# Altium schematic sheet FPGA_FPGA.SchDoc
size A2
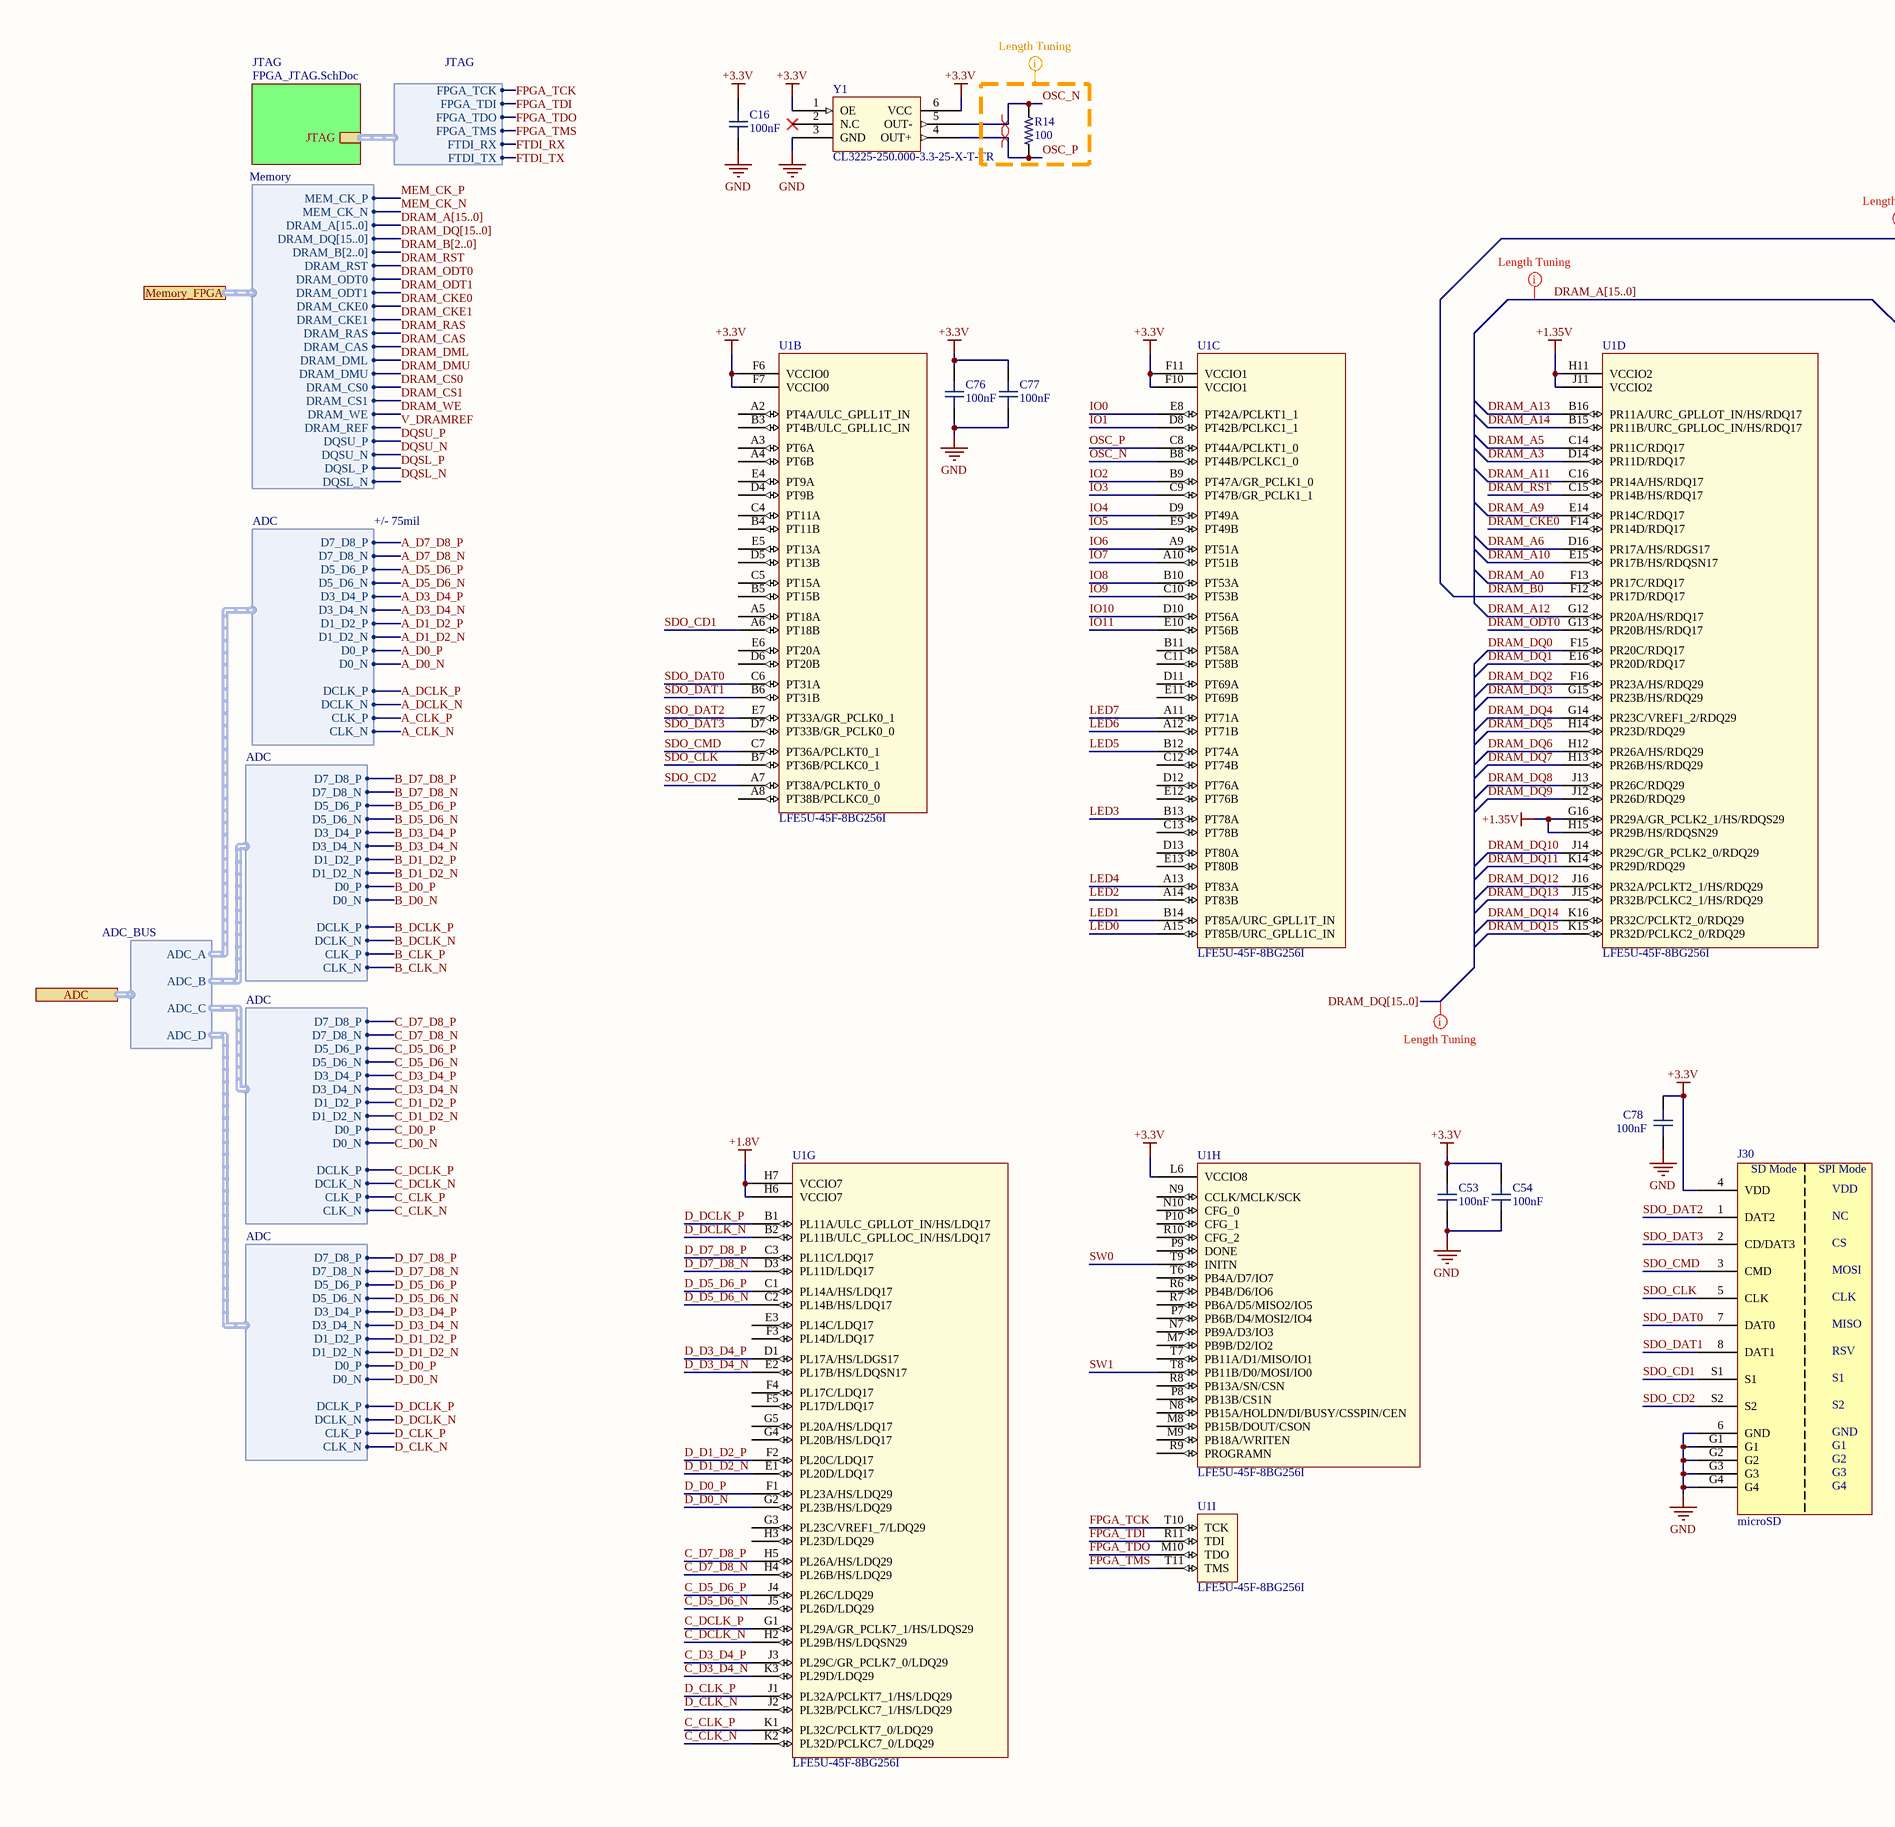
[diagram p0: FPGA_FPGA.SchDoc, left]
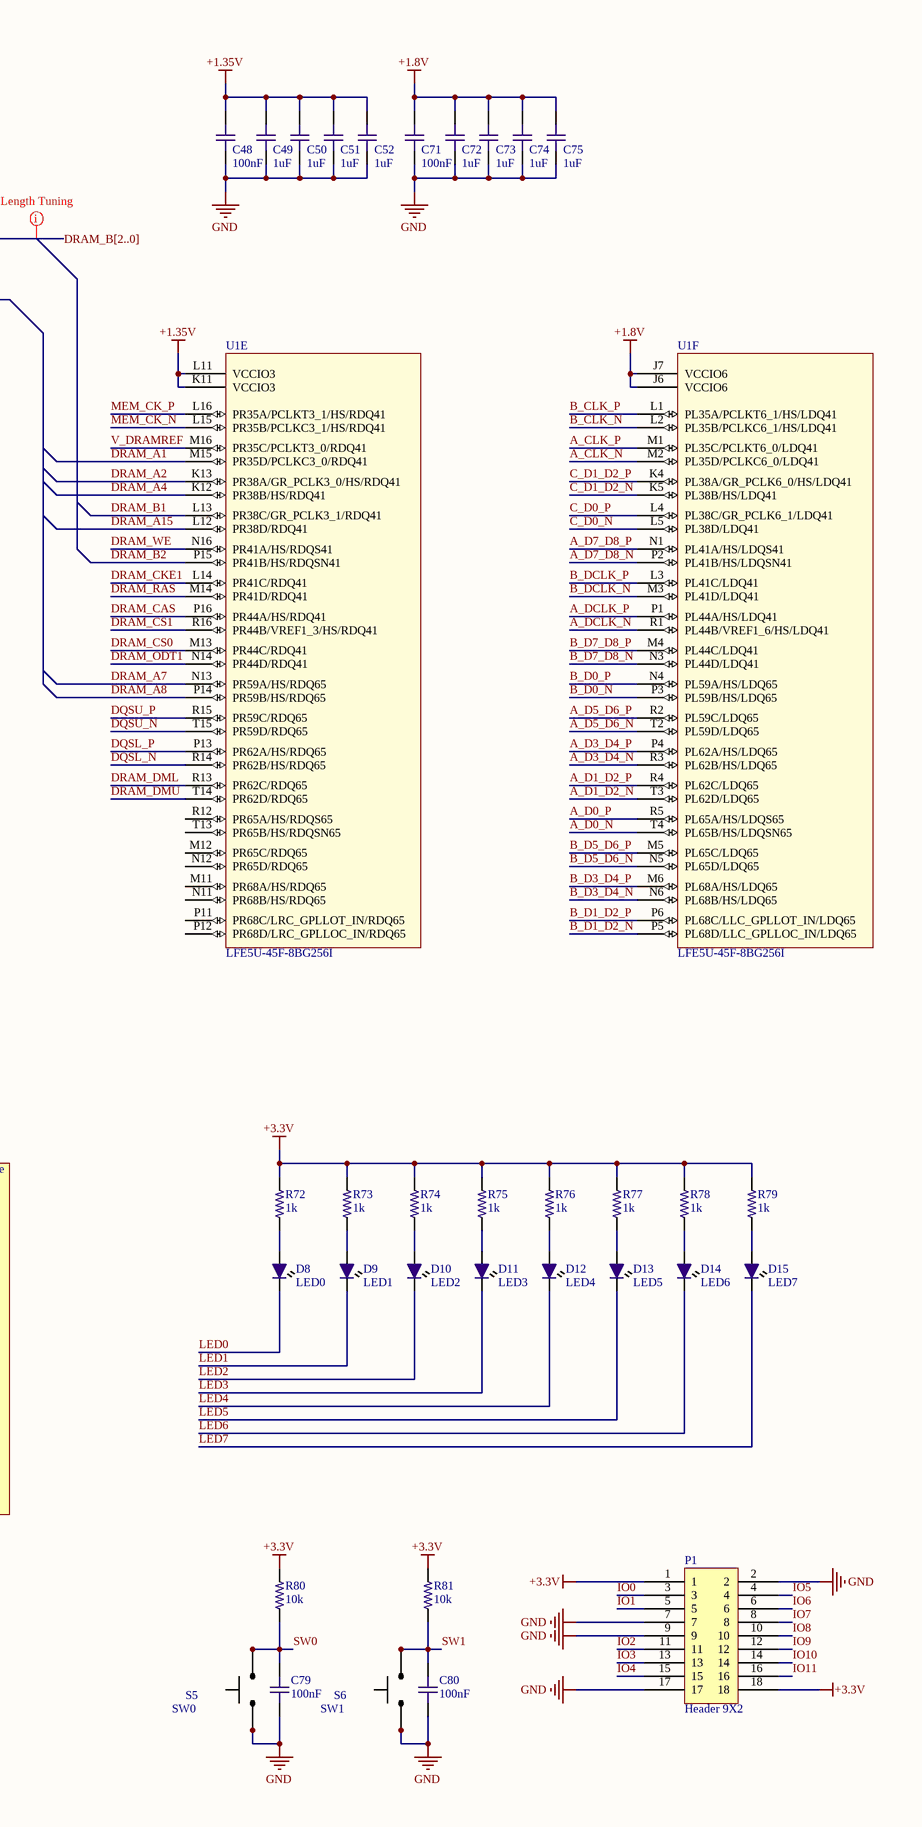
[diagram p1: FPGA_FPGA.SchDoc, right]

## Parts
C16  value 100nF  [C0603-HIGH-DENSITY]  (hidden comment: C0603 100nF 25V X7R)
C48  value 100nF  [C0603-HIGH-DENSITY]  (hidden comment: C0603 100nF 25V X7R)
C49  value 1uF  [C0603-HIGH-DENSITY]  (hidden comment: C0603 1uF 25V X7R)
C50  value 1uF  [C0603-HIGH-DENSITY]  (hidden comment: C0603 1uF 25V X7R)
C51  value 1uF  [C0603-HIGH-DENSITY]  (hidden comment: C0603 1uF 25V X7R)
C52  value 1uF  [C0603-HIGH-DENSITY]  (hidden comment: C0603 1uF 25V X7R)
C53  value 100nF  [C0603-HIGH-DENSITY]  (hidden comment: C0603 100nF 25V X7R)
C54  value 100nF  [C0603-HIGH-DENSITY]  (hidden comment: C0603 100nF 25V X7R)
C71  value 100nF  [C0603-HIGH-DENSITY]  (hidden comment: C0603 100nF 25V X7R)
C72  value 1uF  [C0603-HIGH-DENSITY]  (hidden comment: C0603 1uF 25V X7R)
C73  value 1uF  [C0603-HIGH-DENSITY]  (hidden comment: C0603 1uF 25V X7R)
C74  value 1uF  [C0603-HIGH-DENSITY]  (hidden comment: C0603 1uF 25V X7R)
C75  value 1uF  [C0603-HIGH-DENSITY]  (hidden comment: C0603 1uF 25V X7R)
C76  value 100nF  [C0603-HIGH-DENSITY]  (hidden comment: C0603 100nF 25V X7R)
C77  value 100nF  [C0603-HIGH-DENSITY]  (hidden comment: C0603 100nF 25V X7R)
C78  value 100nF  [C0603-HIGH-DENSITY]  (hidden comment: C0603 100nF 25V X7R)
C79  value 100nF  [C0603-HIGH-DENSITY]  (hidden comment: C0603 100nF 25V X7R)
C80  value 100nF  [C0603-HIGH-DENSITY]  (hidden comment: C0603 100nF 25V X7R)
D8  LED0  [LED0603-IPC]
D9  LED1  [LED0603-IPC]
D10  LED2  [LED0603-IPC]
D11  LED3  [LED0603-IPC]
D12  LED4  [LED0603-IPC]
D13  LED5  [LED0603-IPC]
D14  LED6  [LED0603-IPC]
D15  LED7  [LED0603-IPC]
J30  microSD  [1040310811]
P1  Header 9X2  [Header 9X2]
R14  value 100  [R0402-HIGH-DENSITY]  (hidden comment: R0402 100R 1%)
R72  value 1k  [R0603-IPC]  (hidden comment: R0603 1K 1%)
R73  value 1k  [R0603-IPC]  (hidden comment: R0603 1K 1%)
R74  value 1k  [R0603-IPC]  (hidden comment: R0603 1K 1%)
R75  value 1k  [R0603-IPC]  (hidden comment: R0603 1K 1%)
R76  value 1k  [R0603-IPC]  (hidden comment: R0603 1K 1%)
R77  value 1k  [R0603-IPC]  (hidden comment: R0603 1K 1%)
R78  value 1k  [R0603-IPC]  (hidden comment: R0603 1K 1%)
R79  value 1k  [R0603-IPC]  (hidden comment: R0603 1K 1%)
R80  value 10k  [R0603-IPC]  (hidden comment: R0603 10K 1%)
R81  value 10k  [R0603-IPC]  (hidden comment: R0603 10K 1%)
S5  SW0  [TL3342F260QG]
S6  SW1  [TL3342F260QG]
U1  LFE5U-45F-8BG256I  [caBGA256]  (parts B,C,D,E,F,G,H,I of 9)
Y1  CL3225-250.000-3.3-25-X-T-TR  [Raltron CL3225]

## Sub-sheets
JTAG = FPGA_JTAG.SchDoc: JTAG (harness JTAG)

## Ports
ADC (harness ADC_BUS), Memory_FPGA (harness Memory)

## Harnesses
JTAG: FPGA_TCK, FPGA_TDI, FPGA_TDO, FPGA_TMS, FTDI_RX, FTDI_TX
ADC_BUS: ADC_A, ADC_B, ADC_C, ADC_D
ADC: D7_D8_P, D7_D8_N, D5_D6_P, D5_D6_N, D3_D4_P, D3_D4_N, D1_D2_P, D1_D2_N, D0_P, D0_N, CLK_P, CLK_N, DCLK_P, DCLK_N
Memory: MEM_CK_P, MEM_CK_N, DRAM_A[15..0], DRAM_DQ[15..0], DRAM_B[2..0], DRAM_RST, DRAM_ODT0, DRAM_ODT1, DRAM_CKE0, DRAM_CKE1, DRAM_RAS, DRAM_CAS, DRAM_DML, DRAM_DMU, DRAM_CS0, DRAM_CS1, DRAM_WE, DRAM_REF, DQSU_P, DQSU_N, DQSL_P, DQSL_N

## Nets
+1.8V: C71.2 C72.2 C73.2 C74.2 C75.2 U1.H6(VCCIO7) U1.H7(VCCIO7) U1.J6(VCCIO6) U1.J7(VCCIO6)
+1.35V: C48.2 C49.2 C50.2 C51.2 C52.2 U1.G16(PR29A/GR_PCLK2_1/HS/RDQS29) U1.H11(VCCIO2) U1.H15(PR29B/HS/RDQSN29) U1.J11(VCCIO2) U1.K11(VCCIO3) U1.L11(VCCIO3)
+3.3V: C16.2 C53.2 C54.2 C76.2 C77.2 C78.1 J30.4(VDD) P1.1 P1.18 R72.2 R73.2 R74.2 R75.2 R76.2 R77.2 R78.2 R79.2 R80.2 R81.2 U1.F6(VCCIO0) U1.F7(VCCIO0) U1.F10(VCCIO1) U1.F11(VCCIO1) U1.L6(VCCIO8) Y1.1(OE) Y1.6(VCC)
GND: C16.1 C48.1 C49.1 C50.1 C51.1 C52.1 C53.1 C54.1 C71.1 C72.1 C73.1 C74.1 C75.1 C76.1 C77.1 C78.2 C79.1 C80.1 J30.6(GND) J30.G1 J30.G2 J30.G3 J30.G4 P1.2 P1.7 P1.9 P1.17 S5.3 S5.4 S6.3 S6.4 Y1.3(GND)
A_CLK_N: U1.M2(PL35D/PCLKC6_0/LDQ41) ; harness ADC.CLK_N
A_CLK_P: U1.M1(PL35C/PCLKT6_0/LDQ41) ; harness ADC.CLK_P
A_D0_N: U1.T4(PL65B/HS/LDQSN65) ; harness ADC.D0_N
A_D0_P: U1.R5(PL65A/HS/LDQS65) ; harness ADC.D0_P
A_D1_D2_N: U1.T3(PL62D/LDQ65) ; harness ADC.D1_D2_N
A_D1_D2_P: U1.R4(PL62C/LDQ65) ; harness ADC.D1_D2_P
A_D3_D4_N: U1.R3(PL62B/HS/LDQ65) ; harness ADC.D3_D4_N
A_D3_D4_P: U1.P4(PL62A/HS/LDQ65) ; harness ADC.D3_D4_P
A_D5_D6_N: U1.T2(PL59D/LDQ65) ; harness ADC.D5_D6_N
A_D5_D6_P: U1.R2(PL59C/LDQ65) ; harness ADC.D5_D6_P
A_D7_D8_N: U1.P2(PL41B/HS/LDQSN41) ; harness ADC.D7_D8_N
A_D7_D8_P: U1.N1(PL41A/HS/LDQS41) ; harness ADC.D7_D8_P
A_DCLK_N: U1.R1(PL44B/VREF1_6/HS/LDQ41) ; harness ADC.DCLK_N
A_DCLK_P: U1.P1(PL44A/HS/LDQ41) ; harness ADC.DCLK_P
B_CLK_N: U1.L2(PL35B/PCLKC6_1/HS/LDQ41) ; harness ADC.CLK_N
B_CLK_P: U1.L1(PL35A/PCLKT6_1/HS/LDQ41) ; harness ADC.CLK_P
B_D0_N: U1.P3(PL59B/HS/LDQ65) ; harness ADC.D0_N
B_D0_P: U1.N4(PL59A/HS/LDQ65) ; harness ADC.D0_P
B_D1_D2_N: U1.P5(PL68D/LLC_GPLLOC_IN/LDQ65) ; harness ADC.D1_D2_N
B_D1_D2_P: U1.P6(PL68C/LLC_GPLLOT_IN/LDQ65) ; harness ADC.D1_D2_P
B_D3_D4_N: U1.N6(PL68B/HS/LDQ65) ; harness ADC.D3_D4_N
B_D3_D4_P: U1.M6(PL68A/HS/LDQ65) ; harness ADC.D3_D4_P
B_D5_D6_N: U1.N5(PL65D/LDQ65) ; harness ADC.D5_D6_N
B_D5_D6_P: U1.M5(PL65C/LDQ65) ; harness ADC.D5_D6_P
B_D7_D8_N: U1.N3(PL44D/LDQ41) ; harness ADC.D7_D8_N
B_D7_D8_P: U1.M4(PL44C/LDQ41) ; harness ADC.D7_D8_P
B_DCLK_N: U1.M3(PL41D/LDQ41) ; harness ADC.DCLK_N
B_DCLK_P: U1.L3(PL41C/LDQ41) ; harness ADC.DCLK_P
C_CLK_N: U1.K2(PL32D/PCLKC7_0/LDQ29) ; harness ADC.CLK_N
C_CLK_P: U1.K1(PL32C/PCLKT7_0/LDQ29) ; harness ADC.CLK_P
C_D0_N: U1.L5(PL38D/LDQ41) ; harness ADC.D0_N
C_D0_P: U1.L4(PL38C/GR_PCLK6_1/LDQ41) ; harness ADC.D0_P
C_D1_D2_N: U1.K5(PL38B/HS/LDQ41) ; harness ADC.D1_D2_N
C_D1_D2_P: U1.K4(PL38A/GR_PCLK6_0/HS/LDQ41) ; harness ADC.D1_D2_P
C_D3_D4_N: U1.K3(PL29D/LDQ29) ; harness ADC.D3_D4_N
C_D3_D4_P: U1.J3(PL29C/GR_PCLK7_0/LDQ29) ; harness ADC.D3_D4_P
C_D5_D6_N: U1.J5(PL26D/LDQ29) ; harness ADC.D5_D6_N
C_D5_D6_P: U1.J4(PL26C/LDQ29) ; harness ADC.D5_D6_P
C_D7_D8_N: U1.H4(PL26B/HS/LDQ29) ; harness ADC.D7_D8_N
C_D7_D8_P: U1.H5(PL26A/HS/LDQ29) ; harness ADC.D7_D8_P
C_DCLK_N: U1.H2(PL29B/HS/LDQSN29) ; harness ADC.DCLK_N
C_DCLK_P: U1.G1(PL29A/GR_PCLK7_1/HS/LDQS29) ; harness ADC.DCLK_P
D_CLK_N: U1.J2(PL32B/PCLKC7_1/HS/LDQ29) ; harness ADC.CLK_N
D_CLK_P: U1.J1(PL32A/PCLKT7_1/HS/LDQ29) ; harness ADC.CLK_P
D_D0_N: U1.G2(PL23B/HS/LDQ29) ; harness ADC.D0_N
D_D0_P: U1.F1(PL23A/HS/LDQ29) ; harness ADC.D0_P
D_D1_D2_N: U1.E1(PL20D/LDQ17) ; harness ADC.D1_D2_N
D_D1_D2_P: U1.F2(PL20C/LDQ17) ; harness ADC.D1_D2_P
D_D3_D4_N: U1.E2(PL17B/HS/LDQSN17) ; harness ADC.D3_D4_N
D_D3_D4_P: U1.D1(PL17A/HS/LDGS17) ; harness ADC.D3_D4_P
D_D5_D6_N: U1.C2(PL14B/HS/LDQ17) ; harness ADC.D5_D6_N
D_D5_D6_P: U1.C1(PL14A/HS/LDQ17) ; harness ADC.D5_D6_P
D_D7_D8_N: U1.D3(PL11D/LDQ17) ; harness ADC.D7_D8_N
D_D7_D8_P: U1.C3(PL11C/LDQ17) ; harness ADC.D7_D8_P
D_DCLK_N: U1.B2(PL11B/ULC_GPLLOC_IN/HS/LDQ17) ; harness ADC.DCLK_N
D_DCLK_P: U1.B1(PL11A/ULC_GPLLOT_IN/HS/LDQ17) ; harness ADC.DCLK_P
DQSL_N: U1.R14(PR62B/HS/RDQ65) ; port Memory_FPGA.DQSL_N
DQSL_P: U1.P13(PR62A/HS/RDQ65) ; port Memory_FPGA.DQSL_P
DQSU_N: U1.T15(PR59D/RDQ65) ; port Memory_FPGA.DQSU_N
DQSU_P: U1.R15(PR59C/RDQ65) ; port Memory_FPGA.DQSU_P
DRAM_A0: U1.F13(PR17C/RDQ17)
DRAM_A1: U1.M15(PR35D/PCLKC3_0/RDQ41)
DRAM_A2: U1.K13(PR38A/GR_PCLK3_0/HS/RDQ41)
DRAM_A3: U1.D14(PR11D/RDQ17)
DRAM_A4: U1.K12(PR38B/HS/RDQ41)
DRAM_A5: U1.C14(PR11C/RDQ17)
DRAM_A6: U1.D16(PR17A/HS/RDGS17)
DRAM_A7: U1.N13(PR59A/HS/RDQ65)
DRAM_A8: U1.P14(PR59B/HS/RDQ65)
DRAM_A9: U1.E14(PR14C/RDQ17)
DRAM_A10: U1.E15(PR17B/HS/RDQSN17)
DRAM_A11: U1.C16(PR14A/HS/RDQ17)
DRAM_A12: U1.G12(PR20A/HS/RDQ17)
DRAM_A13: U1.B16(PR11A/URC_GPLLOT_IN/HS/RDQ17)
DRAM_A14: U1.B15(PR11B/URC_GPLLOC_IN/HS/RDQ17)
DRAM_A15: U1.L12(PR38D/RDQ41)
DRAM_B0: U1.F12(PR17D/RDQ17)
DRAM_B1: U1.L13(PR38C/GR_PCLK3_1/RDQ41)
DRAM_B2: U1.P15(PR41B/HS/RDQSN41)
DRAM_CAS: U1.P16(PR44A/HS/RDQ41) ; port Memory_FPGA.DRAM_CAS
DRAM_CKE0: U1.F14(PR14D/RDQ17) ; port Memory_FPGA.DRAM_CKE0
DRAM_CKE1: U1.L14(PR41C/RDQ41) ; port Memory_FPGA.DRAM_CKE1
DRAM_CS0: U1.M13(PR44C/RDQ41) ; port Memory_FPGA.DRAM_CS0
DRAM_CS1: U1.R16(PR44B/VREF1_3/HS/RDQ41) ; port Memory_FPGA.DRAM_CS1
DRAM_DML: U1.R13(PR62C/RDQ65) ; port Memory_FPGA.DRAM_DML
DRAM_DMU: U1.T14(PR62D/RDQ65) ; port Memory_FPGA.DRAM_DMU
DRAM_DQ0: U1.F15(PR20C/RDQ17)
DRAM_DQ1: U1.E16(PR20D/RDQ17)
DRAM_DQ2: U1.F16(PR23A/HS/RDQ29)
DRAM_DQ3: U1.G15(PR23B/HS/RDQ29)
DRAM_DQ4: U1.G14(PR23C/VREF1_2/RDQ29)
DRAM_DQ5: U1.H14(PR23D/RDQ29)
DRAM_DQ6: U1.H12(PR26A/HS/RDQ29)
DRAM_DQ7: U1.H13(PR26B/HS/RDQ29)
DRAM_DQ8: U1.J13(PR26C/RDQ29)
DRAM_DQ9: U1.J12(PR26D/RDQ29)
DRAM_DQ10: U1.J14(PR29C/GR_PCLK2_0/RDQ29)
DRAM_DQ11: U1.K14(PR29D/RDQ29)
DRAM_DQ12: U1.J16(PR32A/PCLKT2_1/HS/RDQ29)
DRAM_DQ13: U1.J15(PR32B/PCLKC2_1/HS/RDQ29)
DRAM_DQ14: U1.K16(PR32C/PCLKT2_0/RDQ29)
DRAM_DQ15: U1.K15(PR32D/PCLKC2_0/RDQ29)
DRAM_ODT0: U1.G13(PR20B/HS/RDQ17) ; port Memory_FPGA.DRAM_ODT0
DRAM_ODT1: U1.N14(PR44D/RDQ41) ; port Memory_FPGA.DRAM_ODT1
DRAM_RAS: U1.M14(PR41D/RDQ41) ; port Memory_FPGA.DRAM_RAS
DRAM_RST: U1.C15(PR14B/HS/RDQ17) ; port Memory_FPGA.DRAM_RST
DRAM_WE: U1.N16(PR41A/HS/RDQS41) ; port Memory_FPGA.DRAM_WE
FPGA_TCK: U1.T10(TCK) ; sheet JTAG/JTAG.FPGA_TCK
FPGA_TDI: U1.R11(TDI) ; sheet JTAG/JTAG.FPGA_TDI
FPGA_TDO: U1.M10(TDO) ; sheet JTAG/JTAG.FPGA_TDO
FPGA_TMS: U1.T11(TMS) ; sheet JTAG/JTAG.FPGA_TMS
FTDI_RX: sheet JTAG/JTAG.FTDI_RX
FTDI_TX: sheet JTAG/JTAG.FTDI_TX
IO0: P1.3 U1.E8(PT42A/PCLKT1_1)
IO1: P1.5 U1.D8(PT42B/PCLKC1_1)
IO2: P1.11 U1.B9(PT47A/GR_PCLK1_0)
IO3: P1.13 U1.C9(PT47B/GR_PCLK1_1)
IO4: P1.15 U1.D9(PT49A)
IO5: P1.4 U1.E9(PT49B)
IO6: P1.6 U1.A9(PT51A)
IO7: P1.8 U1.A10(PT51B)
IO8: P1.10 U1.B10(PT53A)
IO9: P1.12 U1.C10(PT53B)
IO10: P1.14 U1.D10(PT56A)
IO11: P1.16 U1.E10(PT56B)
LED0: D8.K U1.A15(PT85B/URC_GPLL1C_IN)
LED1: D9.K U1.B14(PT85A/URC_GPLL1T_IN)
LED2: D10.K U1.A14(PT83B)
LED3: D11.K U1.B13(PT78A)
LED4: D12.K U1.A13(PT83A)
LED5: D13.K U1.B12(PT74A)
LED6: D14.K U1.A12(PT71B)
LED7: D15.K U1.A11(PT71A)
MEM_CK_N: U1.L15(PR35B/PCLKC3_1/HS/RDQ41) ; port Memory_FPGA.MEM_CK_N
MEM_CK_P: U1.L16(PR35A/PCLKT3_1/HS/RDQ41) ; port Memory_FPGA.MEM_CK_P
OSC_N: R14.2 U1.B8(PT44B/PCLKC1_0) Y1.5(OUT-)
OSC_P: R14.1 U1.C8(PT44A/PCLKT1_0) Y1.4(OUT+)
SDO_CD1: J30.S1 U1.A6(PT18B)
SDO_CD2: J30.S2 U1.A7(PT38A/PCLKT0_0)
SDO_CLK: J30.5(CLK) U1.B7(PT36B/PCLKC0_1)
SDO_CMD: J30.3(CMD) U1.C7(PT36A/PCLKT0_1)
SDO_DAT0: J30.7(DAT0) U1.C6(PT31A)
SDO_DAT1: J30.8(DAT1) U1.B6(PT31B)
SDO_DAT2: J30.1(DAT2) U1.E7(PT33A/GR_PCLK0_1)
SDO_DAT3: J30.2(CD/DAT3) U1.D7(PT33B/GR_PCLK0_0)
SW0: C79.2 R80.1 S5.1 S5.2 U1.T9(INITN)
SW1: C80.2 R81.1 S6.1 S6.2 U1.T8(PB11B/D0/MOSI/IO0)
V_DRAMREF: U1.M16(PR35C/PCLKT3_0/RDQ41) ; port Memory_FPGA.DRAM_REF
NetD8_A: D8.A R72.1
NetD9_A: D9.A R73.1
NetD10_A: D10.A R74.1
NetD11_A: D11.A R75.1
NetD12_A: D12.A R76.1
NetD13_A: D13.A R77.1
NetD14_A: D14.A R78.1
NetD15_A: D15.A R79.1

Not connected (* = marked no-connect by the designer): U1 A2(PT4A/ULC_GPLL1T_IN) A3(PT6A) A4(PT6B) A5(PT18A) A8(PT38B/PCLKC0_0) B3(PT4B/ULC_GPLL1C_IN) B4(PT11B) B5(PT15B) B11(PT58A) C4(PT11A) C5(PT15A) C11(PT58B) C12(PT74B) C13(PT78B) D4(PT9B) D5(PT13B) D6(PT20B) D11(PT69A) D12(PT76A) D13(PT80A) E3(PL14C/LDQ17) E4(PT9A) E5(PT13A) E6(PT20A) E11(PT69B) E12(PT76B) E13(PT80B) F3(PL14D/LDQ17) F4(PL17C/LDQ17) F5(PL17D/LDQ17) G3(PL23C/VREF1_7/LDQ29) G4(PL20B/HS/LDQ17) G5(PL20A/HS/LDQ17) H3(PL23D/LDQ29) M7(PB9B/D2/IO2) M8(PB15B/DOUT/CSON) M9(PB18A/WRITEN) M11(PR68A/HS/RDQ65) M12(PR65C/RDQ65) N7(PB9A/D3/IO3) N8(PB15A/HOLDN/DI/BUSY/CSSPIN/CEN) N9(CCLK/MCLK/SCK) N10(CFG_0) N11(PR68B/HS/RDQ65) N12(PR65D/RDQ65) P7(PB6B/D4/MOSI2/IO4) P8(PB13B/CS1N) P9(DONE) P10(CFG_1) P11(PR68C/LRC_GPLLOT_IN/RDQ65) P12(PR68D/LRC_GPLLOC_IN/RDQ65) R6(PB4B/D6/IO6) R7(PB6A/D5/MISO2/IO5) R8(PB13A/SN/CSN) R9(PROGRAMN) R10(CFG_2) R12(PR65A/HS/RDQS65) T6(PB4A/D7/IO7) T7(PB11A/D1/MISO/IO1) T13(PR65B/HS/RDQSN65); Y1 2(N.C)*

## Buses and harness runs
bus DRAM_A[15..0]
bus DRAM_B[2..0]
bus DRAM_DQ[15..0]

## Layout directives
differential pair; net class DIFF100: OSC_N, OSC_P
net class OSC - 37.5mil: OSC_N, OSC_P
net class DRAM_DATA - 150mil: (no net found under the mark)
net class DRAM_B - 150mil: (no net found under the mark)
net class DRAM_ADD - 150mil: (no net found under the mark)

## Notes on the sheet
- +/- 75mil
- (in symbol microSD) SD Mode; SPI Mode; NC; CS; MOSI; MISO; RSV

## Library data of the parts
C16 C48 C53 C54 C71 C76-C80 = C0603 100nF 25V X7R: Chip Capacitor, 0603, 100nF, 25V, X7R; EIA Code: X7R; Max. Voltage: 25V; Supplier 1: Digi-Key; Supplier Part Number 1: 490-1524-1-ND
C49-C52 C72-C75 = C0603 1uF 25V X7R: CAP CER 1UF 25V X7R 0603; EIA Code: X7R; Max. Voltage: 25V; Features: Soft Termination; Supplier 1: Digi-Key; Supplier Part Number 1: 445-173615-1-ND
D8-D15 = LED 0603 Green: LED GREEN CLEAR 0603 SMD; Supplier 1: Digi-Key; Supplier Part Number 1: 732-4971-1-ND
  D8: Value: Green
J30 = microSD: CONN MICRO SD CARD PUSH-PULL R/A; Supplier 1: Digi-Key; Supplier Part Number 1: WM6357CT-ND
P1 = Header 9X2: 0.254mm
R14 = R0402 100R 1%: Chip Resistor, 0402, 100 ohms, 1%, 1/16 W; Supplier 1: Digi-Key; Supplier Part Number 1: 311-100LRCT-ND
R72-R79 = R0603 1K 1%: RES SMD 1K OHM 1% 1/10W 0603; Temperature Coefficient: ±100ppm/°C; Operating Temperature: -55°C ~ 155°C; Features: Automotive AEC-Q200; Tolerance: ±1%; Supplier 1: Digi-Key; Supplier Part Number 1: RMCF0603FG1K00CT-ND
R80 R81 = R0603 10K 1%: RES SMD 10K OHM 1% 1/10W 0603; Supplier 1: Digi-Key; Supplier Part Number 1: RMCF0603FT10K0CT-ND
S5 S6 = SWITCH TACTILE SPST: SWITCH TACTILE SPST-NO 0.05A 12V; Manufacturer Part Number: TL3342F260QG; Supplier 1: Digi-Key; Supplier Part Number 1: EG5470CT-ND
U1 = ECP5-45F-CABGA256: Lattice ECP5 45k LUTs / IC FPGA 197 I/O 256CABGA; Supplier 1: Digi-Key; Supplier 2: Mouser; Supplier Part Number 1: 220-2201-ND; Supplier Part Number 2: 842-LFE5U45F8BG256I
Y1 = CL3225-250.000-3.3-25-X-T-TR: 250MHz XO (Standard) LVDS Oscillator 3.3V Enable/Disable 6-SMD, No Lead; MFN: EPSON; Supplier 1: Digi-Key; Supplier Part Number 1: 2151-CL3225-250.000-3.3-25-X-T-TRCT-ND